# EAGLE design microscopeControlBoard_v1.5 (EAGLE 7.7.0)
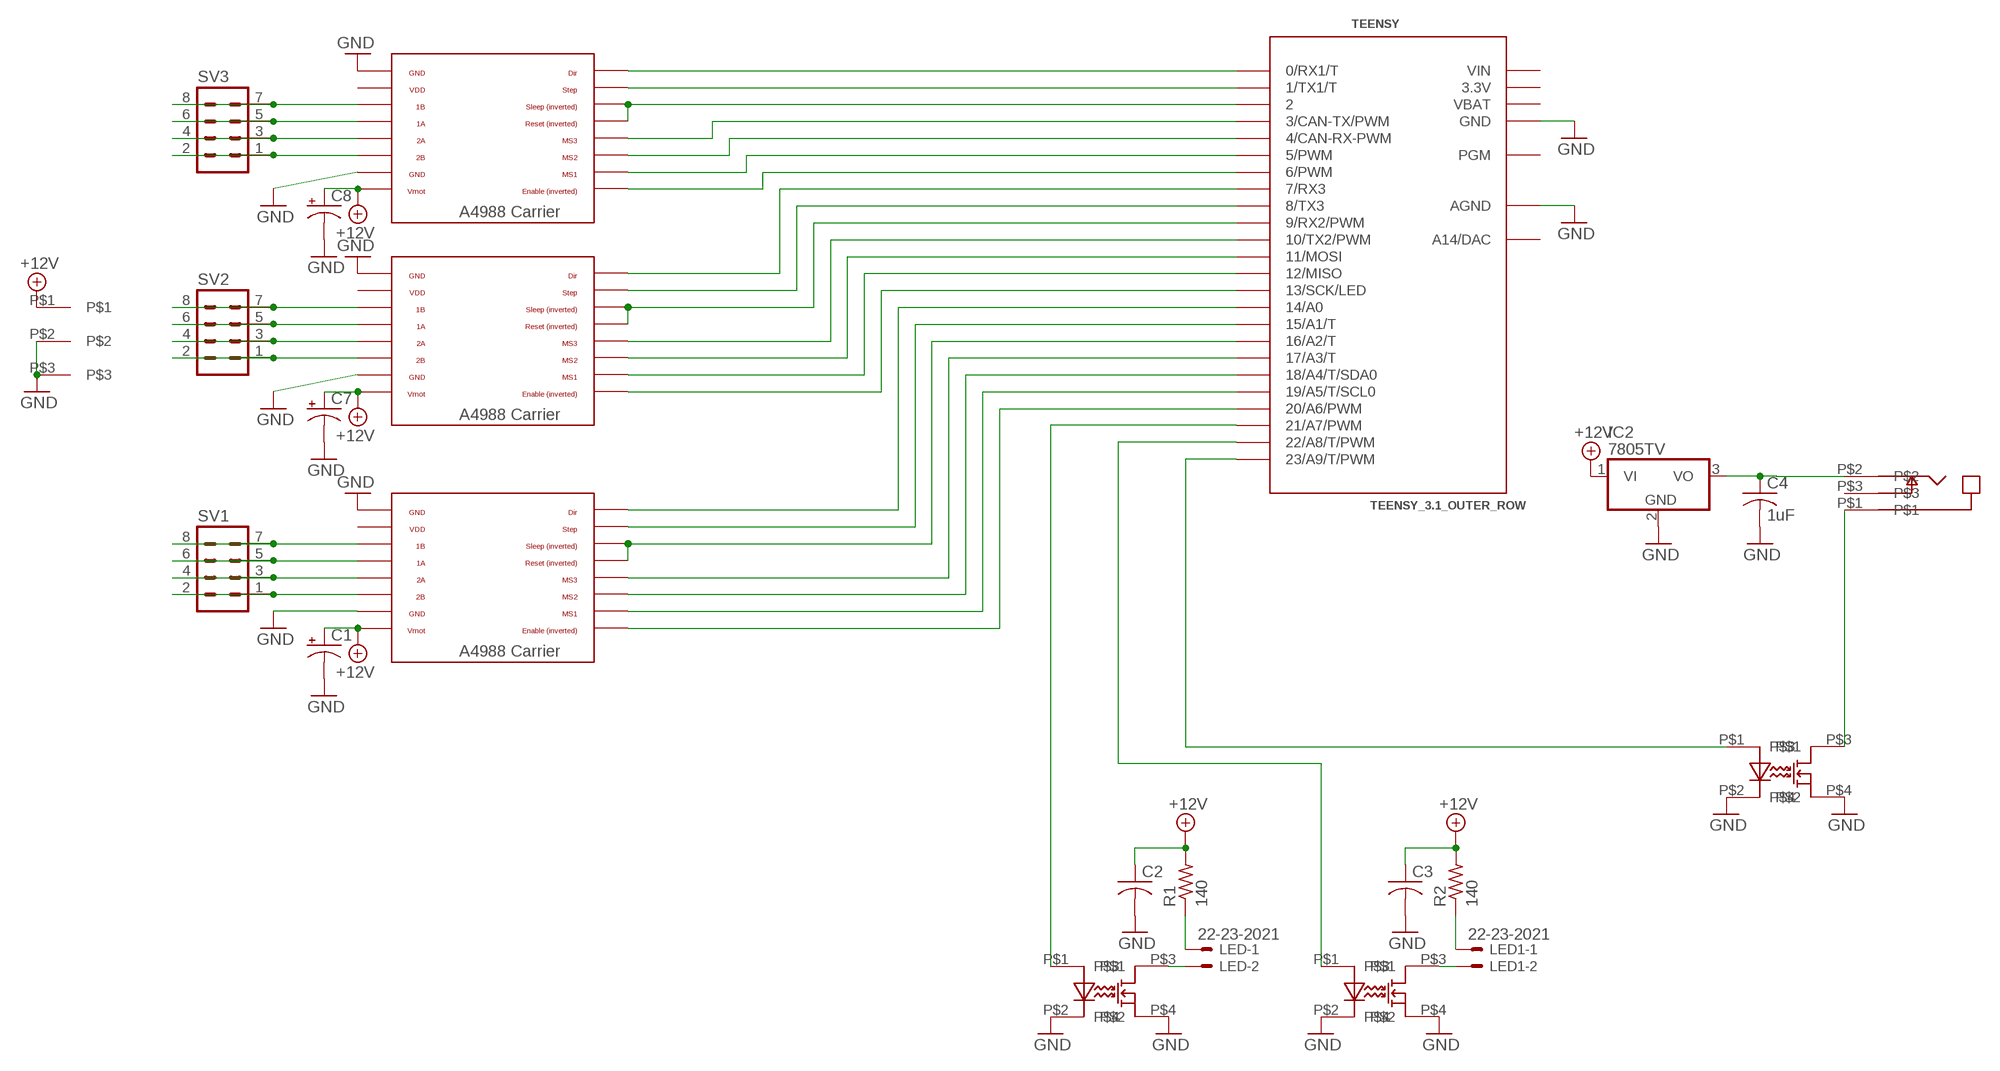
[diagram p0: schematic, sheet 1]

## Parts
C1  CAP_POLPTH4  [CPOL-RADIAL-1000UF-25V]
C2  C-USC0805  [C0805]
C3  C-USC0805  [C0805]
C4  1uF  C-USC0805  [C0805]
C7  CAP_POLPTH4  [CPOL-RADIAL-1000UF-25V]
C8  CAP_POLPTH4  [CPOL-RADIAL-1000UF-25V]
DRV8825_1  A4983CARRIER  [A4988BREAKOUT]
IC2  7805TV  [TO220V]
LED  22-23-2021  [22-23-2021]
LED1  22-23-2021  [22-23-2021]
R1  140  R-US_R2512  [R2512]
R2  140  R-US_R2512  [R2512]
SV1  MA04-2  [MA04-2]
SV2  MA04-2  [MA04-2]
SV3  MA04-2  [MA04-2]
TEENSY  TEENSY_3.1_OUTER_ROW  [TEENSY3-OUTER_ROW]
U$1  A4983CARRIER  [A4988BREAKOUT]
U$2  CPC1002  [CPC1002]
U$3  A4983CARRIER  [A4988BREAKOUT]
U$4  PWRJACK2  [PWRJACK2]
U$5  CPC1002  [CPC1002]
U$6  CPC1002  [CPC1002]
U$7  CP-2523MJCT-ND  [CP-2523MJCT-ND]

## Nets
+12V: C1.+ C2.1 C3.1 C7.+ C8.+ DRV8825_1.VMOT IC2.1(VI) R1.2 R2.2 U$1.VMOT U$3.VMOT U$4.P$1
GND: C1.- C2.2 C3.2 C4.2 C7.- C8.- DRV8825_1.GND DRV8825_1.GND@0(GND) IC2.2(GND) TEENSY.AGND TEENSY.GND TEENSY.GND1(GND) U$1.GND U$1.GND@0(GND) U$2.P$2 U$2.P$4 U$3.GND U$3.GND@0(GND) U$4.P$2 U$4.P$3 U$5.P$2 U$5.P$4 U$6.P$2 U$6.P$4
N$1: LED.1 R1.1
N$2: TEENSY.22/A8(22/A8/T/PWM) U$2.P$1
N$3: DRV8825_1.DIR TEENSY.0(0/RX1/T)
N$4: DRV8825_1.STEP TEENSY.1(1/TX1/T)
N$5: DRV8825_1.RST DRV8825_1.SLP(SLEEP) TEENSY.2
N$6: TEENSY.9(9/RX2/PWM) U$3.RST U$3.SLP(SLEEP)
N$7: TEENSY.7(7/RX3) U$3.DIR
N$8: TEENSY.8(8/TX3) U$3.STEP
N$9: TEENSY.14/A0 U$1.DIR
N$10: TEENSY.15/A1(15/A1/T) U$1.STEP
N$11: TEENSY.16/A2(16/A2/T) U$1.RST U$1.SLP(SLEEP)
N$12: DRV8825_1.EN TEENSY.6(6/PWM)
N$13: LED1.2 U$2.P$3
N$14: TEENSY.17/A3(17/A3/T) U$1.MS3
N$15: TEENSY.18/A4(18/A4/T/SDA0) U$1.MS2
N$16: TEENSY.19/A5(19/A5/T/SCL0) U$1.MS1
N$17: TEENSY.20/A6(20/A6/PWM) U$1.EN
N$18: DRV8825_1.1B SV3.7 SV3.8
N$19: DRV8825_1.1A SV3.5 SV3.6
N$20: DRV8825_1.2A SV3.3 SV3.4
N$21: DRV8825_1.2B SV3.1 SV3.2
N$22: SV2.7 SV2.8 U$3.1B
N$23: SV2.5 SV2.6 U$3.1A
N$24: SV2.3 SV2.4 U$3.2A
N$25: SV2.1 SV2.2 U$3.2B
N$26: SV1.7 SV1.8 U$1.1B
N$27: LED1.1 R2.1
N$28: TEENSY.21/A7(21/A7/PWM) U$6.P$1
N$29: SV1.5 SV1.6 U$1.1A
N$30: LED.2 U$6.P$3
N$31: TEENSY.23/A9(23/A9/T/PWM) U$5.P$1
N$33: SV1.3 SV1.4 U$1.2A
N$34: TEENSY.13(13/SCK/LED) U$3.EN
N$35: DRV8825_1.MS3 TEENSY.3(3/CAN-TX/PWM)
N$36: DRV8825_1.MS2 TEENSY.4(4/CAN-RX-PWM)
N$37: DRV8825_1.MS1 TEENSY.5(5/PWM)
N$38: SV1.1 SV1.2 U$1.2B
N$39: TEENSY.10(10/TX2/PWM) U$3.MS3
N$40: TEENSY.11(11/MOSI) U$3.MS2
N$41: TEENSY.12(12/MISO) U$3.MS1
N$43: C4.1 IC2.3(VO) U$7.P$2
N$44: U$5.P$3 U$7.P$1
Unconnected: TEENSY.PGM TEENSY.RESET/DAC(A14/DAC) U$7.P$3

## Power pins joined to a net without a drawn wire
3.3V: TEENSY.3.3V TEENSY.3.3V1(3.3V)
VBAT: TEENSY.VBAT
VDD: DRV8825_1.VDD U$1.VDD U$3.VDD
VIN: TEENSY.VIN

## Library data of the parts
C1 C7 C8 = SparkFun-Capacitors:CAP_POL: Capacitor Polarized These are standard SMD and PTH capacitors. Normally 10uF, 47uF, and 100uF in electrolytic and tantalum varieties. Always verify the external diameter of the through hole cap, it varies with capacity, voltage, and manufacturer. The EIA devices should be standard.
C2-C4 = resistor:C-US: CAPACITOR, American symbol
DRV8825_1 U$1 U$3 = RepRapjr:A4983CARRIER
IC2 = linear:78*: Positive VOLTAGE REGULATOR Source: http://cache.national.com/ds/LM/LM78L05.pdf http://www.fairchildsemi.com/ds/LM/LM7805.pdf
LED LED1 = con-molex:22-23-2021: .100" (2.54mm) Center Header - 2 Pin; MF: MOLEX; MPN: 22-23-2021; OC_FARNELL: 1462926; OC_NEWARK: 25C3832
R1 R2 = resistor:R-US_: RESISTOR, American symbol
SV1-SV3 = con-lstb:MA04-2: PIN HEADER; OC_FARNELL: unknown; OC_NEWARK: unknown
TEENSY = Teensy_3_and_LC_Series_Boards_v1.1:TEENSY_3.1_OUTER_ROW: Footprint for Teensy 3.1 or 3.2 board using all pin connections on the outer perimeter
U$2 U$5 U$6 = nate4:CPC1002
U$4 = nate4:PWRJACK2
U$7 = nate4:CP-2523MJCT-ND

## Board
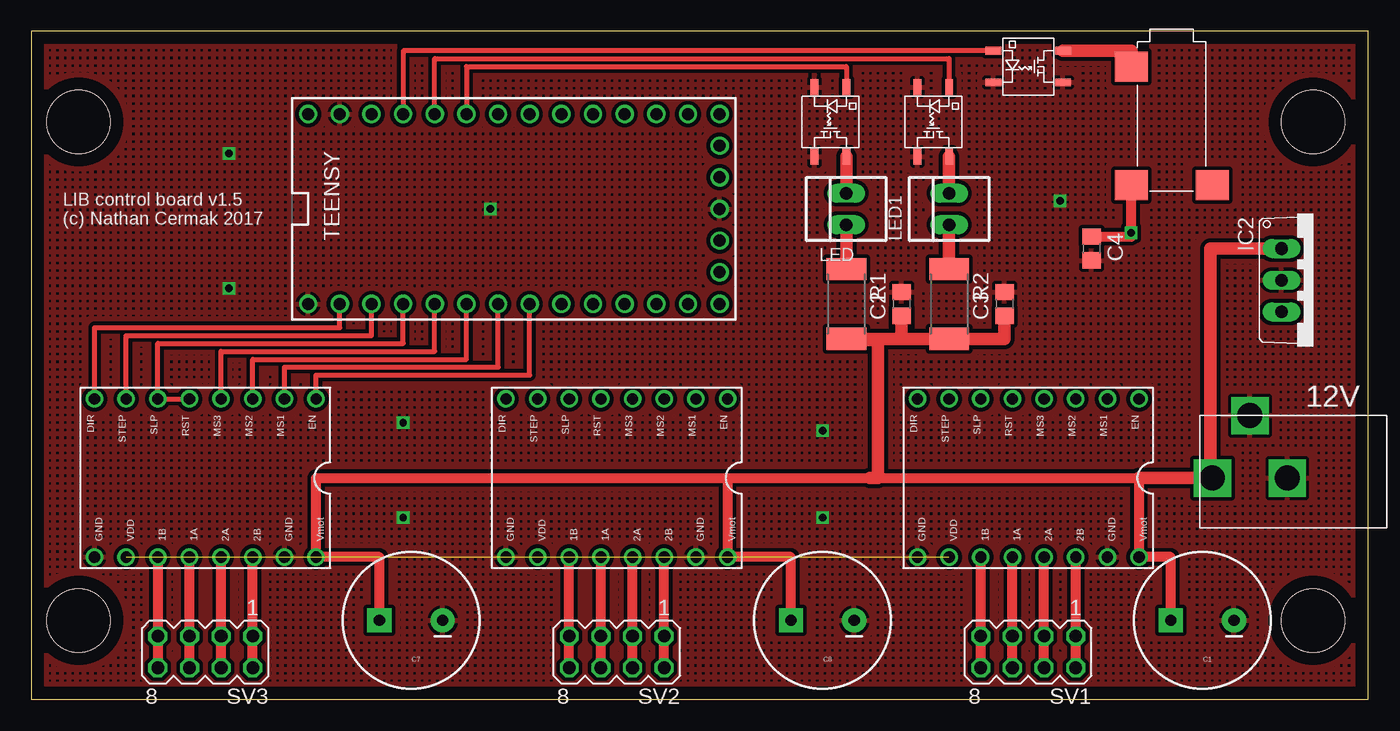
[diagram p1: board, top side]
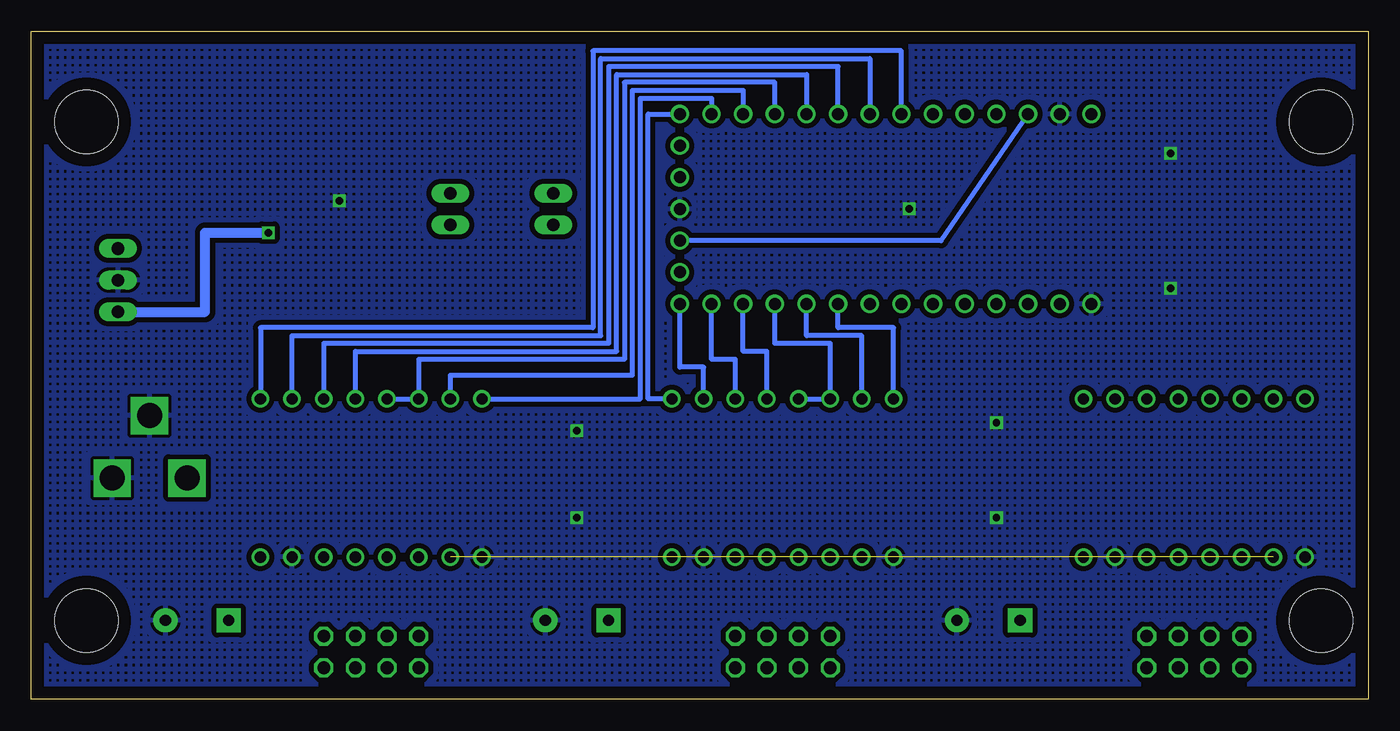
[diagram p2: board, bottom side, seen from below]

Size 107.3 x 53.65 mm. Coordinates in mm from the lower left corner, seen from the top.
Outline: 107.3,0 107.3,53.65 0,53.65 0,0 107.3,0
Copper layers (1*16): Top 0.035mm / dielectric 1.5mm / Bottom 0.035mm
Design rules "default": minimum track width 10mil, minimum drill 24mil, track to track 8mil, track to pad 8mil, pad to pad 8mil, via to via 8mil, smd to smd 8mil, copper to edge 40mil, drill to drill 8mil, minimum pad ring 10mil, minimum via ring 8mil, stop-mask expansion 4mil, vias tented up to drill 0mil, thermal gap 10mil
Holes 5.08 mm at 3.81,6.35 3.81,46.35 102.87,6.35 102.87,46.35

### Footprints (pad centres in the part's own frame; a part is rotated, then mirrored left to right if it is on the bottom)
CPOL-RADIAL-1000UF-25V = drill 0.9 pad 1.93 square: + 2.54,0 | drill 0.9 pad 1.93: - -2.54,0
C0805 = smd 1.3 x 1.5: 1 -0.95,0; 2 0.95,0
A4988BREAKOUT = drill 0.9: 1A 8.89,1.27; 1B 11.43,1.27; 2A 6.35,1.27; 2B 3.81,1.27; DIR 16.51,-11.43; EN -1.27,-11.43; GND 16.51,1.27; GND@0 1.27,1.27; MS1 1.27,-11.43; MS2 3.81,-11.43; MS3 6.35,-11.43; RST 8.89,-11.43; SLP 11.43,-11.43; STEP 13.97,-11.43; VDD 13.97,1.27; VMOT -1.27,1.27
TO220V = drill 1.016 long: 1 -2.54,-2.54; 2 0,-2.54; 3 2.54,-2.54
22-23-2021 = drill 1 long: 1 -1.27,0; 2 1.27,0
R2512 = smd 1.8 x 3.2: 1 -2.8,0; 2 2.8,0
MA04-2 = drill 1.016 octagon: 1 -3.81,-1.27; 2 -3.81,1.27; 3 -1.27,-1.27; 4 -1.27,1.27; 5 1.27,-1.27; 6 1.27,1.27; 7 3.81,-1.27; 8 3.81,1.27
TEENSY3-OUTER_ROW = drill 0.965: 0 -7.62,13.97; 1 -7.62,11.43; 2 -7.62,8.89; 3 -7.62,6.35; 3.3V 7.62,11.43; 3.3V1 -2.54,-16.51; 4 -7.62,3.81; 5 -7.62,1.27; 6 -7.62,-1.27; 7 -7.62,-3.81; 8 -7.62,-6.35; 9 -7.62,-8.89; 10 -7.62,-11.43; 11 -7.62,-13.97; 12 -7.62,-16.51; 13 7.62,-16.51; 14/A0 7.62,-13.97; 15/A1 7.62,-11.43; 16/A2 7.62,-8.89; 17/A3 7.62,-6.35; 18/A4 7.62,-3.81; 19/A5 7.62,-1.27; 20/A6 7.62,1.27; 21/A7 7.62,3.81; 22/A8 7.62,6.35; 23/A9 7.62,8.89; AGND 7.62,13.97; GND -7.62,16.51; GND1 0,-16.51; PGM 2.54,-16.51; RESET/DAC 5.08,-16.51; VBAT -5.08,-16.51; VIN 7.62,16.51
CPC1002 = smd 1.27 x 0.635: P$1 -2.794,1.27; P$2 -2.794,-1.27; P$3 2.794,1.27; P$4 2.794,-1.27
PWRJACK2 = drill 2 square: P$1 -3,0; P$2 3,0; P$3 0,5
CP-2523MJCT-ND = smd 2.4 x 2.65: P$1 0,0; P$2 9.5,0; P$3 9.5,6.5

### Placement (x,y rotation side)
C1  93.98,6.35 180 top
C2  69.85,31.75 90 top
C3  78.11,31.75 90 top
C4  85.09,36.2 270 top
C7  30.48,6.35 180 top
C8  63.5,6.35 180 top
DRV8825_1  21.59,12.7 180 top
IC2  102.87,33.66 270 top
LED  65.41,39.37 90 top
LED1  73.66,39.37 90 top
R1  65.41,31.75 270 top
R2  73.66,31.75 270 top
SV1  80.01,3.81 180 top
SV2  46.99,3.81 180 top
SV3  13.97,3.81 180 top
TEENSY  38.73,39.37 90 top
U$1  87.63,12.7 180 top
U$2  72.39,46.35 270 top
U$3  54.61,12.7 180 top
U$4  97.79,17.78 0 top
U$5  80.01,50.8 0 top
U$6  64.14,46.35 270 top
U$7  88.27,50.8 270 top

### Tracks (layer width: path | path; a pad name or v marks a point on that pad's centre or on a via)
3.3V
  Bottom 0.406: TEENSY.3.3V 34.29,36.83 TEENSY.3.3V1
+12V
  Top 0.813: C7.+ 27.94,11.43 DRV8825_1.VMOT 22.86,17.78 55.88,17.78 | C1.+ 91.44,11.43 U$1.VMOT 88.9,17.78 67.31,17.78 55.88,17.78 | 55.88,17.78 U$3.VMOT 60.96,11.43 C8.+
  Top 1.016: 88.9,17.78 U$4.P$1 | U$4.P$1 93.98,17.78 | 67.31,17.78 67.94,17.78 67.94,28.83 R1.2 69.85,28.95 | 69.85,28.95 R2.2 78.11,28.95 C3.1 | 69.85,28.95 C2.1 | U$4.P$1 94.61,17.95 94.61,36.2 IC2.1
GND  (via drill 0.6)
  other vias: 15.88,43.81 82.55,40.01 29.84,22.23 15.88,33.02 29.84,14.61 63.5,14.61 63.5,21.59 36.83,39.37
  pour Top (isolate 0.305, hatched): 0,53.98 107.31,53.98 107.31,0 0,0
  pour Bottom (isolate 0.406, hatched): 0,0 0,53.98 107.31,53.98 107.31,0
N$1
  Top 1.016: R1.1 LED.1
N$2
  Top 0.406: TEENSY.22/A8 32.38,51.44 73.66,51.44 U$2.P$1
N$3
  Top 0.406: DRV8825_1.DIR 5.08,29.84 24.77,29.84 TEENSY.0
N$4
  Top 0.406: DRV8825_1.STEP 7.62,29.21 27.3,29.21 TEENSY.1
N$5
  Top 0.406: TEENSY.2 29.84,28.57 10.16,28.57 DRV8825_1.SLP DRV8825_1.RST
N$6
  Bottom 0.406: TEENSY.9 47.62,28.57 43.18,28.57 U$3.SLP U$3.RST
N$7
  Bottom 0.406: U$3.DIR 38.1,29.84 42.55,29.84 TEENSY.7
N$8
  Bottom 0.406: U$3.STEP 40.64,29.21 45.09,29.21 TEENSY.8
N$9
  Bottom 0.406: U$1.DIR 58.42,24.13 58.42,48.26 52.7,48.26 TEENSY.14/A0
N$10
  Bottom 0.406: U$1.STEP 73.66,26.04 59.05,26.04 59.05,48.9 50.16,48.9 TEENSY.15/A1
N$11
  Bottom 0.406: TEENSY.16/A2 47.62,49.53 59.69,49.53 59.69,27.3 76.2,27.3 U$1.SLP U$1.RST
N$12
  Top 0.406: DRV8825_1.EN 22.86,26.04 40.01,26.04 TEENSY.6
N$13
  Top 1.016: U$2.P$3 LED1.2
N$14
  Bottom 0.406: U$1.MS3 81.28,27.94 60.33,27.94 60.33,50.16 45.09,50.16 TEENSY.17/A3
N$15
  Bottom 0.406: TEENSY.18/A4 42.55,50.8 60.96,50.8 60.96,28.57 83.82,28.57 U$1.MS2
N$16
  Bottom 0.406: U$1.MS1 86.36,29.21 61.59,29.21 61.59,51.44 40.01,51.44 TEENSY.19/A5
N$17
  Bottom 0.406: TEENSY.20/A6 37.47,52.07 62.23,52.07 62.23,29.84 88.9,29.84 U$1.EN
N$18
  Top 0.813: DRV8825_1.1B SV3.7 SV3.8
N$19
  Top 0.813: SV3.6 SV3.5 DRV8825_1.1A
N$20
  Top 0.813: SV3.4 SV3.3 DRV8825_1.2A
N$21
  Top 0.813: SV3.2 SV3.1 DRV8825_1.2B
N$22
  Top 0.813: SV2.8 SV2.7 U$3.1B
N$23
  Top 0.813: SV2.6 SV2.5 U$3.1A
N$24
  Top 0.813: SV2.4 SV2.3 U$3.2A
N$25
  Top 0.813: SV2.2 SV2.1 U$3.2B
N$26
  Top 0.813: SV1.8 SV1.7 U$1.1B
N$27
  Top 1.016: R2.1 LED1.1
N$28
  Top 0.406: TEENSY.21/A7 34.92,50.8 65.41,50.8 U$6.P$1
N$29
  Top 0.813: SV1.6 SV1.5 U$1.1A
N$30
  Top 1.016: LED.2 U$6.P$3
N$31
  Top 0.406: U$5.P$1 76.83,52.07 29.84,52.07 TEENSY.23/A9
N$33
  Top 0.813: SV1.4 SV1.3 U$1.2A
N$34
  Bottom 0.406: U$3.EN 57.78,24.13 57.78,46.99 TEENSY.13
N$35
  Top 0.406: DRV8825_1.MS3 15.24,27.94 32.38,27.94 TEENSY.3
N$36
  Top 0.406: DRV8825_1.MS2 17.78,27.3 34.92,27.3 TEENSY.4
N$37
  Top 0.406: DRV8825_1.MS1 20.32,26.67 37.47,26.67 TEENSY.5
N$38
  Top 0.813: SV1.2 SV1.1 U$1.2B
N$39
  Bottom 0.406: U$3.MS3 48.26,27.94 50.16,27.94 TEENSY.10
N$40
  Bottom 0.406: U$3.MS2 50.8,27.3 52.7,27.3 TEENSY.11
N$41
  Bottom 0.406: U$3.MS1 53.34,26.67 55.24,26.67 TEENSY.12
N$43  (via drill 0.6)
  Top 0.813: C4.1 88.27,37.15 U$7.P$2 v88.27,37.47
  Bottom 0.813: v88.27,37.47 93.34,37.47 93.34,31.11 IC2.3
N$44
  Top 1.016: 88.27,50.55 U$7.P$1 88.27,52.07 U$5.P$3
VDD  (2 unrouted)

### Text on the board
tNames: LIB control board v1.5 / (c) Nathan Cermak 2017 | 12V